# Altium schematic sheet ejection.SchDoc
size A
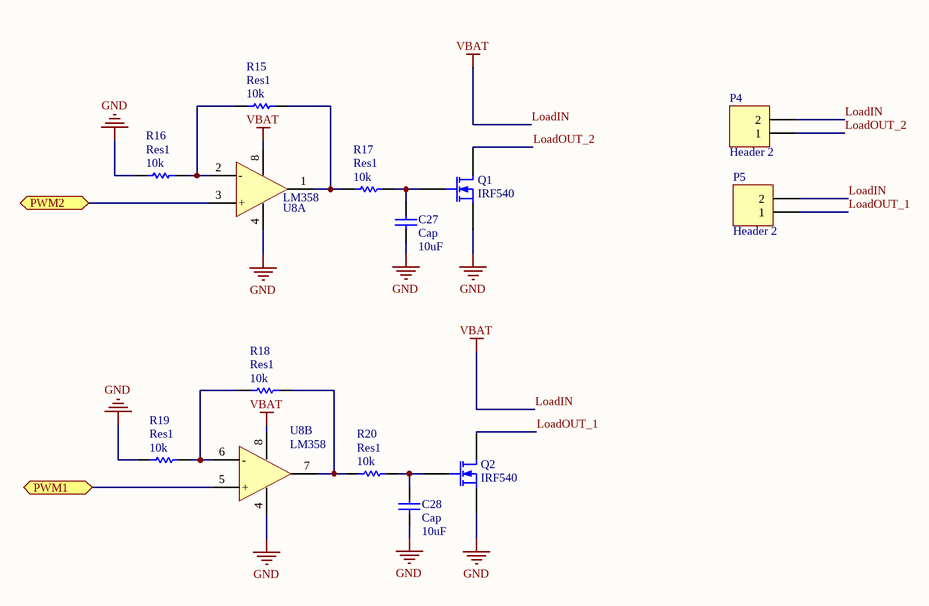
[diagram p0: ejection.SchDoc]

## Parts
C27  Cap  value 10uF  [0805-CAP]
C28  Cap  value 10uF  [0805-CAP]
P4  Header 2  [Battery 2]
P5  Header 2  [Battery 2]
Q1  IRF540  [TO-263-AA]
Q2  IRF540  [TO-263-AA]
R15  Res1  value 10k  [0805-RES]
R16  Res1  value 10k  [0805-RES]
R17  Res1  value 10k  [0805-RES]
R18  Res1  value 10k  [0805-RES]
R19  Res1  value 10k  [0805-RES]
R20  Res1  value 10k  [0805-RES]
U8  LM358  [SOIC-8]  (parts A,B of 2)

## Ports
PWM1, PWM2

## Nets
GND: C27.1 C28.1 Q1.3(S) Q2.3(S) R16.1 R19.1 U8.4(VCC-)
LoadIN: P4.2 P5.2 U8.8(VCC+)  [also labelled VBAT]
LoadOUT_1: P5.1 Q2.1(D)
LoadOUT_2: P4.1 Q1.1(D)
PWM1: U8.5(+) ; port PWM1
PWM2: U8.3(+) ; port PWM2
NetC27_2: C27.2 Q1.2(G) R17.2
NetC28_2: C28.2 Q2.2(G) R20.2
NetR15_1: R15.1 R16.2 U8.2(-)
NetR15_2: R15.2 R17.1 U8.1(OUT)
NetR18_1: R18.1 R19.2 U8.6(-)
NetR18_2: R18.2 R20.1 U8.7(OUT)

## Library data of the parts
C27 C28 = Cap: Capacitor; Published: 8-Jun-2000; LatestRevisionDate: 17-Jul-2002; LatestRevisionNote: Re-released for DXP Platform.; PackageReference: RAD-0.3; Publisher: Altium Limited; PackageDescription: Radial Cap, Thru-Hole; 2 Leads; 0.3 in Pin Spacing
P4 P5 = Header 2: Header, 2-Pin; LatestRevisionDate: 17-Jul-2002; LatestRevisionNote: Re-released for DXP Platform.; Publisher: Altium Limited
Q1 Q2 = MOSFET-N: N-Channel MOSFET; Published: 8-Jun-2000; LatestRevisionDate: 17-Jul-2002; LatestRevisionNote: Re-released for DXP Platform.; PackageVersion: 1995/1996; PackageReference: E3; Publisher: Altium Limited; PackageDescription: TO, Flat Index; 3 In-Line, Axial Leads; Body Dia. 4.6mm; Lead Dia. 0.5 mm (max)
R15-R20 = Res1: Resistor; Published: 8-Jun-2000; LatestRevisionDate: 17-Jul-2002; LatestRevisionNote: Re-released for DXP Platform.; PackageReference: AXIAL-0.3; Publisher: Altium Limited; PackageDescription: Axial Device, Thru-Hole; 2 Leads; 0.3 in Pin Spacing
U8 = LM358: LM358 OPAMP